# Altium schematic sheet MOS_interface.SchDoc: P-MOSFET analog interface
size A3; Date: 30.05.2015; Author: Michał Gumiela; DocumentNumber: 6; SheetNumber: 6; SheetTotal: 9; Model: EM1; PageSetup: Record=PageOptions|CenterHorizontal=True|CenterVertical=True|PrintScale=0.52|XCorrection=1.00|YCorrection=1.00|PrintKind=1|BorderSize=5000000|LeftOffset=0|BottomOffset=0|Orientation=2|PaperLength=4200|PaperWidth=2970|Scale=100|PaperSource=7|PrintQuality=600|MediaType=1|DitherType=10|PaperKind=A3|PrintScaleMode=1
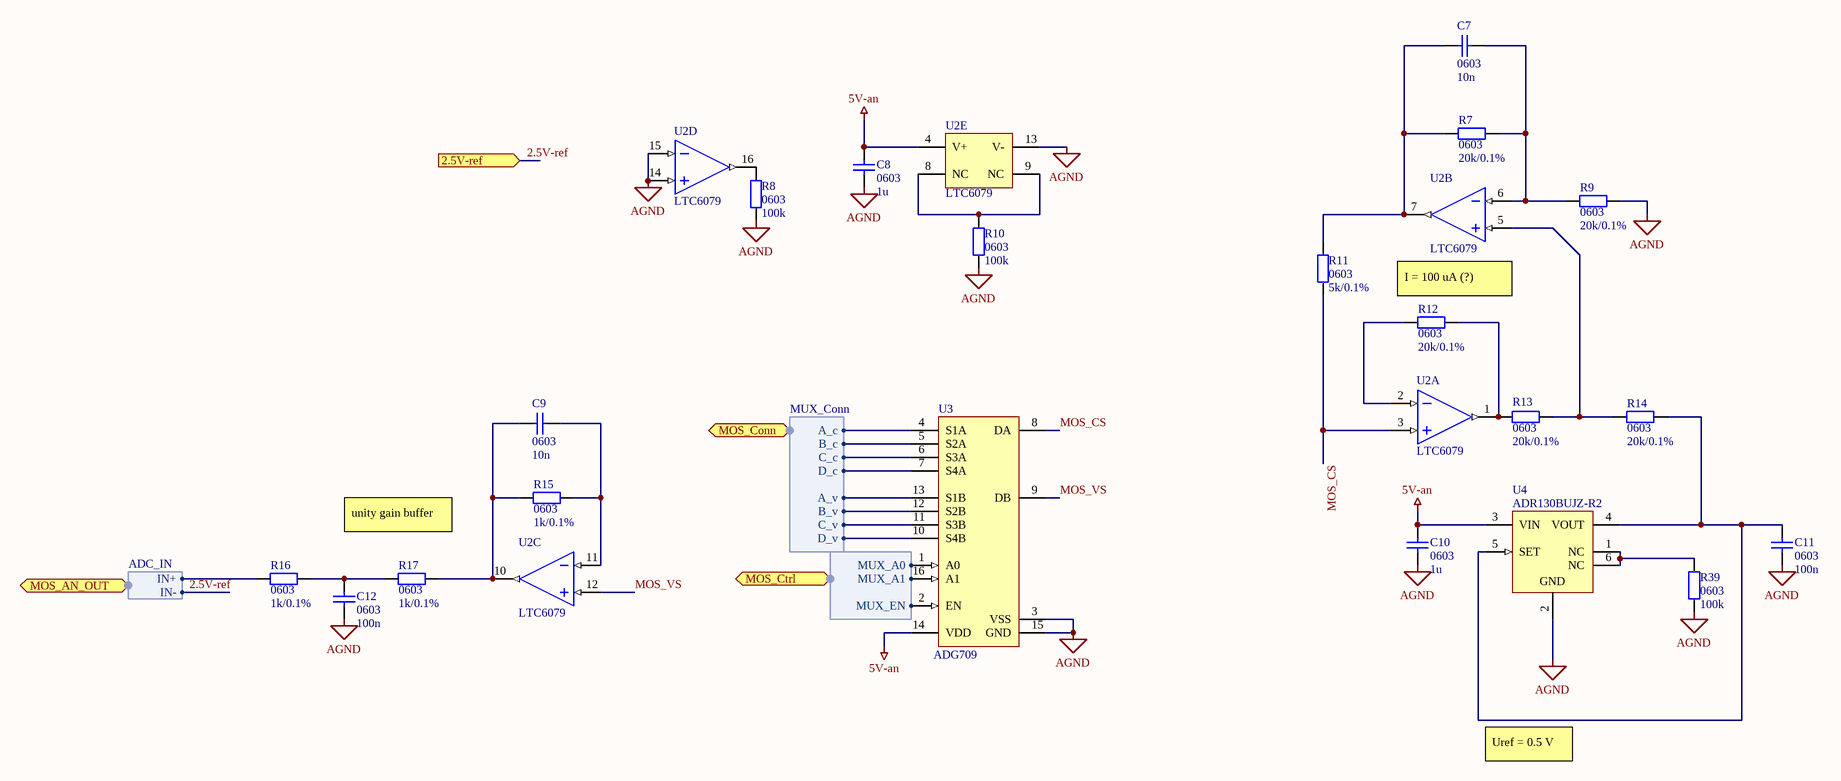
[diagram p0: MOS_interface.SchDoc]

## Parts
C7  0603  value 10n  [SMD_Capacitor_0603]
C8  0603  value 1u  [SMD_Capacitor_0603]
C9  0603  value 10n  [SMD_Capacitor_0603]
C10  0603  value 1u  [SMD_Capacitor_0603]
C11  0603  value 100n  [SMD_Capacitor_0603]
C12  0603  value 100n  [SMD_Capacitor_0603]
R7  0603  value 20k/0.1%  [SMD_Resistor_0603]
R8  0603  value 100k  [SMD_Resistor_0603]
R9  0603  value 20k/0.1%  [SMD_Resistor_0603]
R10  0603  value 100k  [SMD_Resistor_0603]
R11  0603  value 5k/0.1%  [SMD_Resistor_0603]
R12  0603  value 20k/0.1%  [SMD_Resistor_0603]
R13  0603  value 20k/0.1%  [SMD_Resistor_0603]
R14  0603  value 20k/0.1%  [SMD_Resistor_0603]
R15  0603  value 1k/0.1%  [SMD_Resistor_0603]
R16  0603  value 1k/0.1%  [SMD_Resistor_0603]
R17  0603  value 1k/0.1%  [SMD_Resistor_0603]
R39  0603  value 100k  [SMD_Resistor_0603]
U2  LTC6079  [SSOP-16]  (parts A,B,C,D,E of 5)
U3  ADG709  [TSSOP16]
U4  ADR130BUJZ-R2  [ADI-UJ-6_M]

## Ports
2.5V-ref (in), MOS_AN_OUT (harness ADC_IN), MOS_Conn (harness MUX_Conn), MOS_Ctrl (harness MUX_Ctrl)

## Harnesses
MUX_Ctrl: MUX_A0, MUX_A1, MUX_EN
MUX_Conn: A_c, B_c, C_c, D_c, A_v, B_v, C_v, D_v
ADC_IN: IN+, IN-

## Nets
5V-an: C8.2 C10.2 U2.4(V+) U3.14(VDD) U4.3(VIN)
AGND: C8.1 C10.1 C11.1 C12.1 R8.1 R9.1 R10.1 R39.1 U2.13(V-) U2.14(IN+_D) U2.15(IN-_D) U3.3(VSS) U3.15(GND) U4.2(GND)
2.5V-ref: port 2.5V-ref, port MOS_AN_OUT.IN-
MOS_CS: R11.1 U2.3(IN+_A) U3.8(DA)
MOS_VS: U2.12(IN+_C) U3.9(DB)
NetC7_1: C7.1 R7.1 R9.2 U2.6(IN-_B)
NetC7_2: C7.2 R7.2 R11.2 U2.7(OUT_B)
NetC9_1: C9.1 R15.2 U2.11(IN-_C)
NetC9_2: C9.2 R15.1 R17.2 U2.10(OUT_C)
NetC11_2: C11.2 R14.1 U4.4(VOUT) U4.5(SET)
NetC12_2: C12.2 R16.2 R17.1
NetR8_2: R8.2 U2.16(OUT_D)
NetR10_2: R10.2 U2.8(NC) U2.9(NC)
NetR12_1: R12.1 R13.2 U2.1(OUT_A)
NetR12_2: R12.2 U2.2(IN-_A)
NetR13_1: R13.1 R14.2 U2.5(IN+_B)
NetR16_1: R16.1 ; port MOS_AN_OUT.IN+
NetR39_2: R39.2 U4.1(NC) U4.6(NC)
NetU3_1: U3.1(A0) ; port MOS_Ctrl.MUX_A0
NetU3_2: U3.2(EN) ; port MOS_Ctrl.MUX_EN
NetU3_4: U3.4(S1A) ; port MOS_Conn.A_c
NetU3_5: U3.5(S2A) ; port MOS_Conn.B_c
NetU3_6: U3.6(S3A) ; port MOS_Conn.C_c
NetU3_7: U3.7(S4A) ; port MOS_Conn.D_c
NetU3_10: U3.10(S4B) ; port MOS_Conn.D_v
NetU3_11: U3.11(S3B) ; port MOS_Conn.C_v
NetU3_12: U3.12(S2B) ; port MOS_Conn.B_v
NetU3_13: U3.13(S1B) ; port MOS_Conn.A_v
NetU3_16: U3.16(A1) ; port MOS_Ctrl.MUX_A1

## Notes on the sheet
- I = 100 uA (?)
- unity gain buffer
- Uref = 0.5 V
- Title:
- Sheet:
- of
- Author:
- Model:
- Document Number:
- Checked by:
- Iss-Rev:
- Approved by:
- Date:
- File name:

## Library data of the parts
C7-C12 = Cap: Capacitor; Published: 8-Jun-2000; LatestRevisionDate: 17-Jul-2002; LatestRevisionNote: Re-released for DXP Platform.; PackageReference: RAD-0.3; Publisher: Altium Limited; PackageDescription: Radial Cap, Thru-Hole; 2 Leads; 0.3 in Pin Spacing
R7-R17 R39 = Res2: Resistor; Published: 8-Jun-2000; LatestRevisionDate: 17-Jul-2002; LatestRevisionNote: Re-released for DXP Platform.; PackageReference: AXIAL-0.4; Publisher: Altium Limited; PackageDescription: Axial Device, Thru-Hole; 2 Leads; 0.4 in Pin Spacing
U2 = LTC6079: Rail-to-rail, quad operational amplifier. Library compatible with LTC608X LTC607X op-amps; Manufacturer: Linear Technology; Value: LTC6079
U3 = ADG709: CMOS Analog 4-Channel Multiplexer; Manufacturer: Analog Devices; ManufacturerPartNumber: ADG709
U4 = ADR130BUJZ-R2: Precision Series Sub-Band Gap Voltage Reference, 1 V Output, 2 to 18 V Supply, Industrial, 6-pin SOT23 (UJ-6), Reel; Manufacturer: Analog Devices; Max V Supply (V): 18; Min V Supply (V): 2; Ref Out TC (ppm/C): 5; Vout: 0.5V, 1V; DatasheetVersion: Rev. B; PackageVersion: Dec-04; PackageReference: UJ-6; PackageDescription: 6-Pin Thin Small Outline Transistor Package, Body 2.9 x 1.6 mm, Pitch 0.95 mm; Supplier 1: Digi-Key; Supplier Part Number 1: ADR130BUJZ-R2TR-ND; Supplier 2: Digi-Key; Supplier Part Number 2: ADR130BUJZ-R2CT-ND; Supplier 3: Digi-Key; Supplier Part Number 3: ADR130BUJZ-R2DKR-ND; Supplier 4: Farnell; Supplier Part Number 4: 1699555; Supplier 5: Mouser; Supplier Part Number 5: 584-ADR130BUJZ-R2; Packing: Reel; Operating Temp Range: -40 to 125 degC; Mounting Technology: Surface Mount; Code_JEDEC: MO-193-AA; PartNumber: ADR130BUJZ-R2; ComponentLink1Description: Manufacturer URL; ComponentLink1URL: http://www.analog.com/en/index.html; ComponentLink2Description: Datasheet; ComponentLink2URL: http://www.analog.com/static/imported-files/data_sheets/ADR130.pdf; ComponentLink3Description: Package Specification; ComponentLink3URL: http://www.analog.com/static/imported-files/packages/PKG_PDF/TSOT(UJ)/UJ_6.pdf; ComponentLink4Description: URL Link1; ComponentLink4URL: Product URL:http://www.analog.com/en/special-linear-functions/voltage-references/adr130/products/product.html